# EAGLE design raspihat-1 (EAGLE 9.2.0)

## Sheet 1 of 2
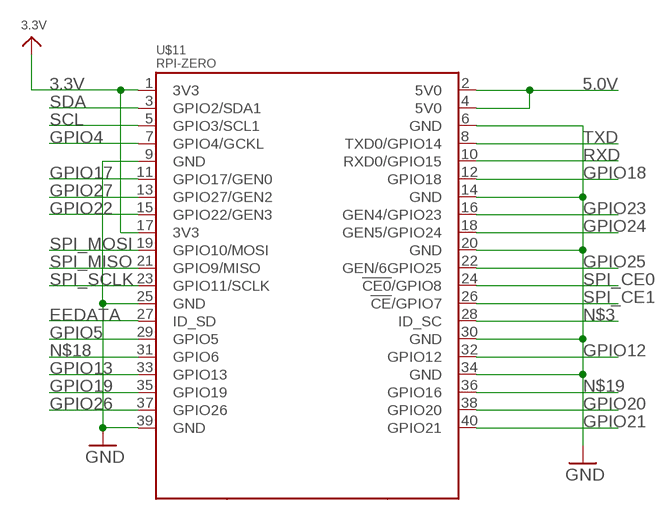
[diagram p0: schematic, sheet 1]

### Parts
U$11  RPI-ZERO  [RASPBERRYPI_BASTELSTUBE_V13_RASPI_BOARD_B+_FULL]

### Nets
3.3V: U$11.1(3V3) U$11.17(3V3) ; also sheet 2
5.0V: U$11.2(5V0) U$11.4(5V0) ; also sheet 2
EEDATA: U$11.27(ID_SD)
GND: U$11.6(GND) U$11.9(GND) U$11.14(GND) U$11.20(GND) U$11.25(GND) U$11.30(GND) U$11.34(GND) U$11.39(GND) ; also sheet 2
GPIO4: U$11.7(GPIO4/GCKL) ; also sheet 2
GPIO5: U$11.29(GPIO5)
GPIO12: U$11.32(GPIO12)
GPIO13: U$11.33(GPIO13)
GPIO17: U$11.11(GPIO17/GEN0) ; also sheet 2
GPIO18: U$11.12(GPIO18) ; also sheet 2
GPIO19: U$11.35(GPIO19)
GPIO20: U$11.38(GPIO20)
GPIO21: U$11.40(GPIO21) ; also sheet 2
GPIO22: U$11.15(GPIO22/GEN3)
GPIO23: U$11.16(GEN4/GPIO23)
GPIO24: U$11.18(GEN5/GPIO24)
GPIO25: U$11.22(GEN/6GPIO25) ; also sheet 2
GPIO26: U$11.37(GPIO26) ; also sheet 2
GPIO27: U$11.13(GPIO27/GEN2)
N$3: U$11.28(ID_SC)
N$18: U$11.31(GPIO6)
N$19: U$11.36(GPIO16)
RXD: U$11.10(RXD0/GPIO15)
SCL: U$11.5(GPIO3/SCL1) ; also sheet 2
SDA: U$11.3(GPIO2/SDA1) ; also sheet 2
SPI_CE0: U$11.24(!CE0!/GPIO8)
SPI_CE1: U$11.26(!CE!/GPIO7)
SPI_MISO: U$11.21(GPIO9/MISO)
SPI_MOSI: U$11.19(GPIO10/MOSI)
SPI_SCLK: U$11.23(GPIO11/SCLK)
TXD: U$11.8(TXD0/GPIO14)

## Sheet 2 of 2: Systems
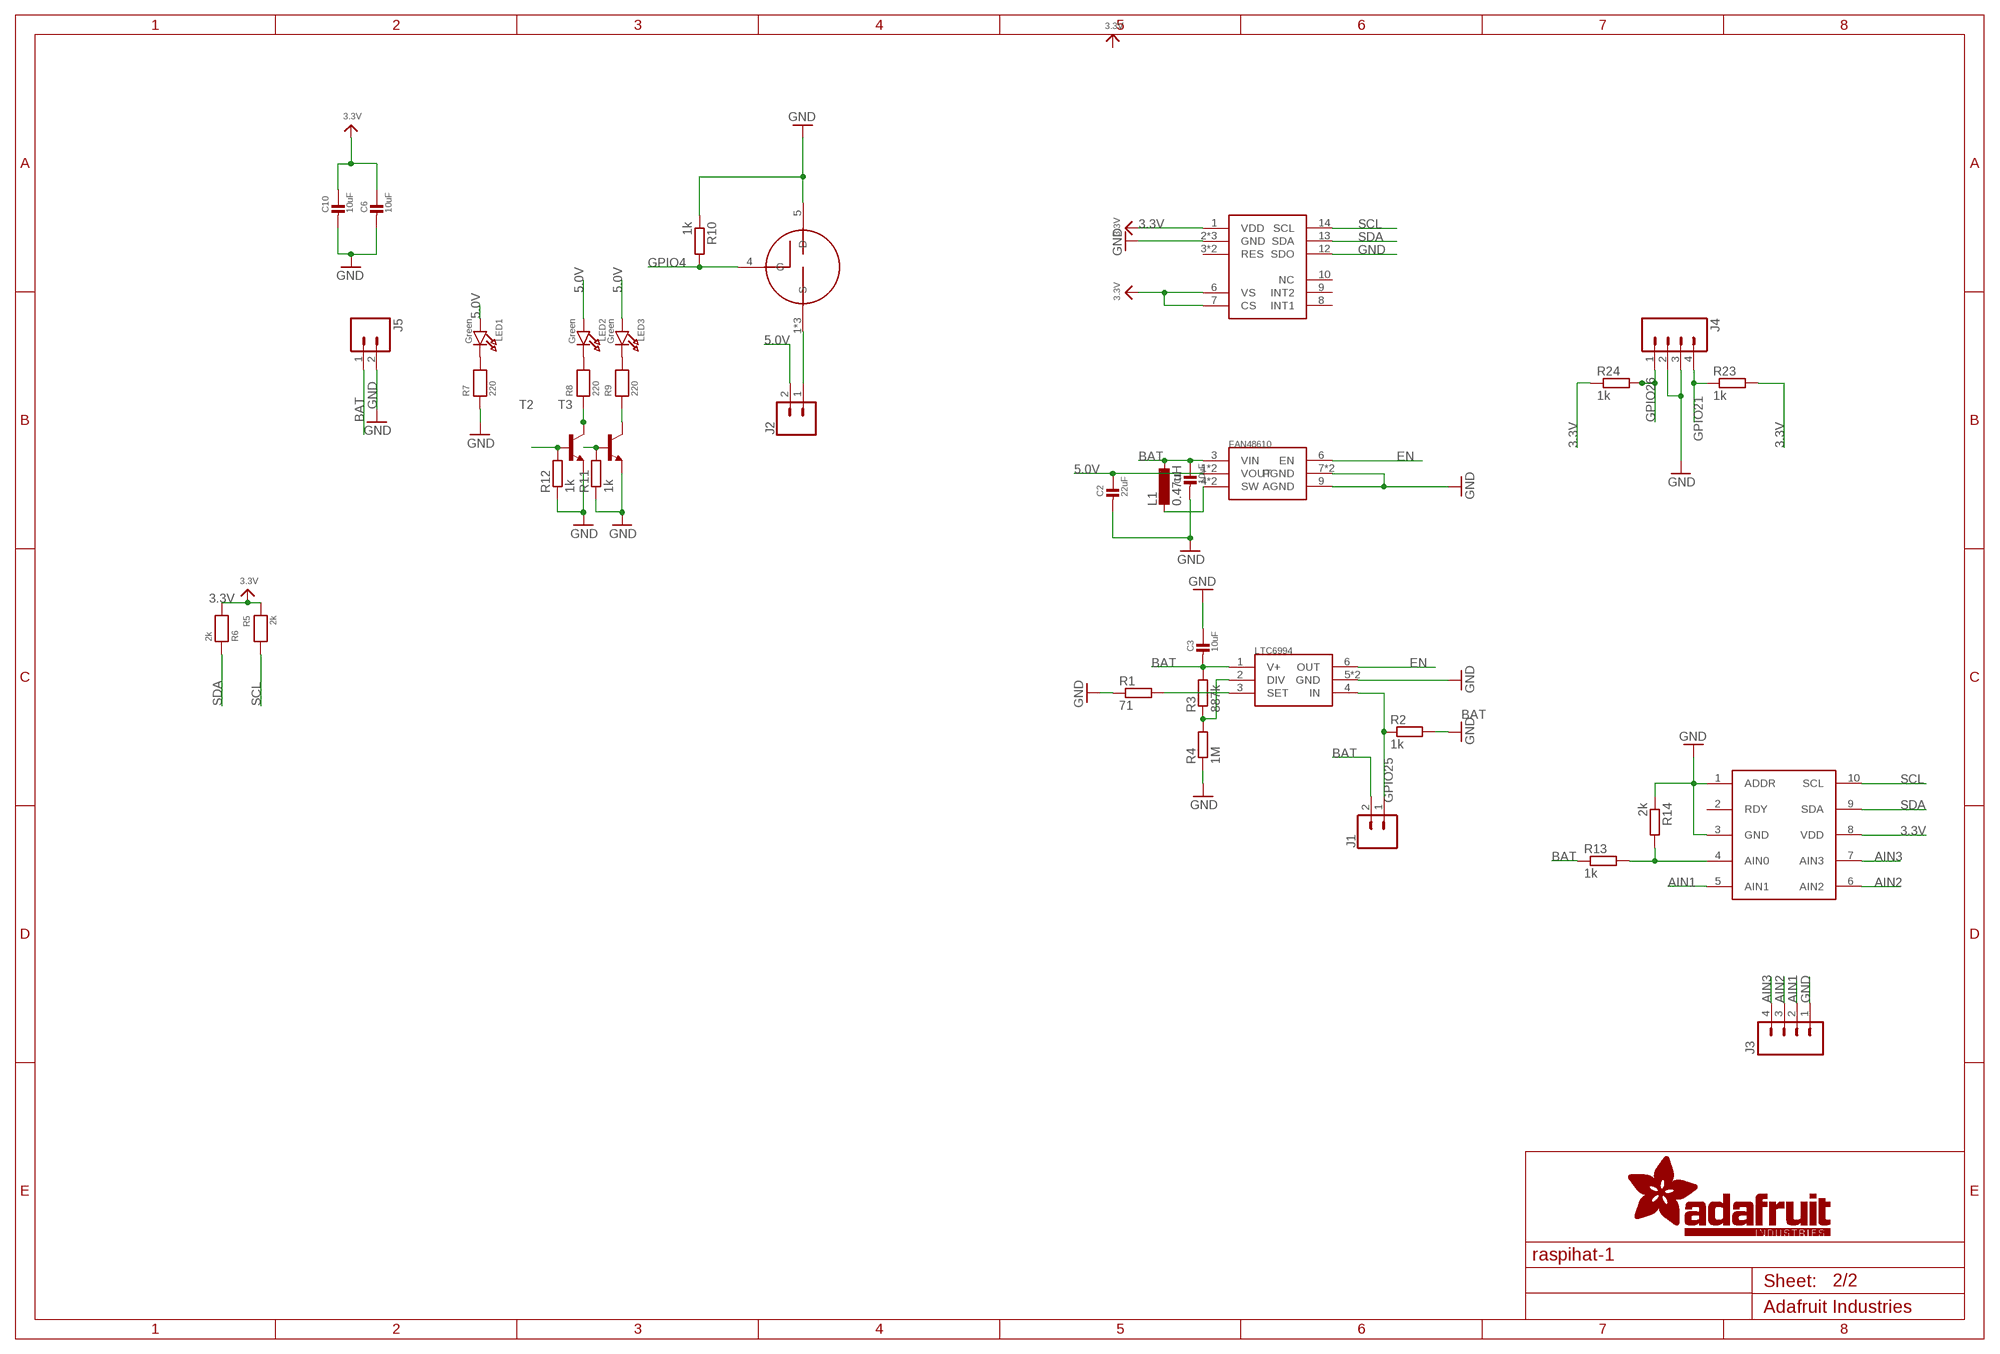
[diagram p1: schematic, sheet 2]

### Parts
C1  10uF  CAP_CERAMIC0805-NOOUTLINE  [0805-NO]
C2  22uF  CAP_CERAMIC0805-NOOUTLINE  [0805-NO]
C3  10uF  CAP_CERAMIC0805-NOOUTLINE  [0805-NO]
C6  10uF  CAP_CERAMIC0805-NOOUTLINE  [0805-NO]
C10  10uF  CAP_CERAMIC0805-NOOUTLINE  [0805-NO]
J1  CONN_02  [1X02]
J2  CONN_02  [1X02]
J3  M04JST  [1X04-1.5MM_JST]
J4  M04JST  [1X04-1.5MM_JST]
J5  M02PTH  [1X02]
L1  0.47uH  L-EUL2012C  [L2012C]
LED1  Green  LED0805_NOOUTLINE  [CHIPLED_0805_NOOUTLINE]
LED2  Green  LED0805_NOOUTLINE  [CHIPLED_0805_NOOUTLINE]
LED3  Green  LED0805_NOOUTLINE  [CHIPLED_0805_NOOUTLINE]
R1  71  R-EU_R0603  [R0603]
R2  1k  R-EU_R0805  [R0805]
R3  887k  R-EU_R0603  [R0603]
R4  1M  R-EU_R0805  [R0805]
R5  2k  RESISTOR0805_NOOUTLINE  [0805-NO]
R6  2k  RESISTOR0805_NOOUTLINE  [0805-NO]
R7  220  RESISTOR0805_NOOUTLINE  [0805-NO]
R8  220  RESISTOR0805_NOOUTLINE  [0805-NO]
R9  220  RESISTOR0805_NOOUTLINE  [0805-NO]
R10  1k  R-EU_R0805  [R0805]
R11  1k  R-EU_R0805  [R0805]
R12  1k  R-EU_R0805  [R0805]
R13  1k  R-EU_R0805  [R0805]
R14  2k  R-EU_R0805  [R0805]
R23  1k  R-EU_R0805  [R0805]
R24  1k  R-EU_R0805  [R0805]
T2  MMBT6517LT1-NPN-SOT23-BEC  [SOT23-BEC]
T3  MMBT6517LT1-NPN-SOT23-BEC  [SOT23-BEC]
U$3  ADXL345  [LGA14]
U$5  FAN48610  [WLCSP-9]
U$6  LTC6994  [DFN-6]
U$8  BUK9M  [LFPAK33]
U$15  ADS1015  [VSSOP10]

### Nets
3.3V: C6.1 C10.1 R5.1 R6.2 R23.2 R24.1 U$3.1(VDD) U$3.6(VS) U$3.7(CS) U$15.8(VDD) ; also sheet 1
5.0V: C2.1 J2.2 LED1.A LED2.A LED3.A U$5.1(VOUT) U$5.2(VOUT) ; also sheet 1
AIN1: J3.2 U$15.5(AIN1)
AIN2: J3.3 U$15.6(AIN2)
AIN3: J3.4 U$15.7(AIN3)
BAT: C1.1 C3.2 J1.2 J5.1 L1.1 R3.2 R13.1 U$5.3(VIN) U$6.1(V+)
EN: U$5.6(EN) U$6.6(OUT)
GND: C1.2 C2.2 C3.1 C6.2 C10.2 J3.1 J4.2 J4.3 J5.2 R1.1 R2.2 R4.1 R7.1 R10.1 R11.1 R12.1 R14.1 T2.E T3.E U$3.2(GND) U$3.4(GND) U$3.5(GND) U$3.12(SDO) U$5.7(PGND) U$5.8(PGND) U$5.9(AGND) U$6.5(GND) U$6.P$1(GND) U$8.5(D) U$15.1(ADDR) U$15.3(GND) ; also sheet 1
GPIO4: R10.2 U$8.4(G) ; also sheet 1
GPIO17: R12.2 T2.B ; also sheet 1
GPIO18: R11.2 T3.B ; also sheet 1
GPIO21: J4.4 R23.1 ; also sheet 1
GPIO25: J1.1 R2.1 U$6.4(IN) ; also sheet 1
GPIO26: J4.1 R24.2 ; also sheet 1
N$1: R1.2 U$6.3(SET)
N$2: R3.1 R4.2 U$6.2(DIV)
N$4: R13.2 R14.2 U$15.4(AIN0)
N$5: L1.2 U$5.4(SW) U$5.5(SW)
N$6: LED2.C R8.2
N$7: LED3.C R9.2
N$8: R8.1 T2.C
N$11: R9.1 T3.C
N$12: J2.1 U$8.1(S) U$8.2(S) U$8.3(S)
N$133: LED1.C R7.2
SCL: R5.2 U$3.14(SCL) U$15.10(SCL) ; also sheet 1
SDA: R6.1 U$3.13(SDA) U$15.9(SDA) ; also sheet 1
Unconnected: U$3.3(RES) U$3.8(INT1) U$3.9(INT2) U$3.10(NC) U$3.11(RES) U$15.2(RDY)

## Library data of the parts
C1-C3 C6 C10 = microbuilder:CAP_CERAMIC: Ceramic Capacitors For new designs, use the packages preceded by an '_' character since they are more reliable: The following footprints should be used on most boards: _0402 - Standard footprint for regular board layouts _0603 - Standard footprint for regular board layouts _0805 - Standard footprint for regular board layouts For extremely tight-pitch boards where space is at a premium, the following 'micro-pitch' footprints can be used (smaller pads, no silkscreen outline, etc.): _0402MP - Micro-pitch footprint for very dense/compact boards _0603MP - Micro-pitch footprint for very dense/compact boards _0805MP - Micro-pitch footprint for very dense/compact boards Commonly Stocked Parts 0402 - 0402 Surface Mount Capacitors 16pF 50V 5% [Digikey: 445-4899-2-ND] 18pF 50V 5% [Digikey: 490-1281-2-ND] 22pF 50V 5% [Digikey: 490-1283-2-ND] 68pF 50V 5% [Digikey: 490-1289-2-ND] 0.1uF 10V 10% [Digikey: 490-1318-2-ND] 1.0uF 6.3V 10% [Digikey: 490-1320-2-ND] 0603 - 0603 Surface Mount Capacitors 16 pF 50V 5% [Digikey: 445-5051-2-ND] 22 pF 50V [Digikey: PCC220ACVTR-ND] 33 pF 50V 5% [Digikey: 490-1415-1-ND] 56pF 50V 5% [Digikey: 490-1421-1-ND] 220pF 50V 5% [Digikey: 445-1285-1-ND] 680 pF 50V 2200 pF 50V 5% C0G [Digikey: 445-1297-1-ND] 5600 pF 100V 5% X7R [Digikey: 478-3711-1-ND] 0.1 µF 25V 10% [Digikey: PCC2277TR-ND] 0.22 µF 16V 10% X7R [Digikey: 445-1318-1-ND] 1.0 µF 25V 10% [Digikey: 445-5146-2-ND] 0603 - RF Specific 3pF 250V +/-0.1pF RF [Digikey: 712-1347-1-ND] 18 pF 250V 5% [Digikey: 478-3505-1-ND or 712-1322-1-ND] 56 pF 250V 5% C0G RF [Digikey: 490-4867-1-ND] 68 pF 250V RF [Digikey: 490-4868-1-ND] 0805 - 0805 Surface Mount Capacitors 220 pF 250V 2% RF Ceramic Capacitor [Digikey: 712-1398-1-ND] 1000 pF 50V 2% NP0 Ceramic Capacitor [Digikey: 478-3760-1-ND] 0.1 µF 25V 10% Ceramic Capacitor [Digikey: PCC1828TR-ND] 1.0 µF 16V 10% Ceramic Capacitor[Digikey: 490-1691-2-ND] 10.0 µF 10V 10% Ceramic Capacitor[Digikey: 709-1228-1-ND] 10.0 uF 16V 10% Ceramic Capacitor [Digikey: 478-5165-2-ND] 47 uF 6.3V 20% Ceramic Capacitor [Digikey: 587-1779-1-ND or 399-5506-1-ND] 1206 - 1206 Surface Mount Capacitors 47uF 10V 20% Ceramic Capacitor [Digikey: 490-5528-1-ND or 399-5508-1-ND or 445-6010-1-ND] 100uF 6.3V -20%, +80% Y5V Ceramic Capacitor (Digikey: 490-4512-1-ND, Mouser: 81-GRM31CF50J107ZE1L)
J1 J2 = SparkFun-Connectors:CONN_02: Multi connection point. Often used as Generic Header-pin footprint for 0.1 inch spaced/style header connections On any of the 0.1 inch spaced packages, you can populate with these: Break Away Headers - Straight <https://www.sparkfun.com/products/116> (PRT-00116) Break Away Male Headers - Right Angle <https://www.sparkfun.com/products/553> (PRT-00553) Female Headers <https://www.sparkfun.com/products/115> (PRT-00115) Break Away Headers - Machine Pin <https://www.sparkfun.com/products/117> (PRT-00117) Break Away Female Headers - Swiss Machine Pin <https://www.sparkfun.com/products/743> (PRT-00743) For SCREWTERMINALS and SPRING TERMINALS visit here: Screw Terimnals on SparkFun.com <https://www.sparkfun.com/search/results?term=Screw+Terminals> (5mm/3.5mm/2.54mm spacing) This device is also useful as a general connection point to wire up your design to another part of your project. Our various solder wires solder well into these plated through hole pads. Hook-Up Wire - Assortment (Stranded, 22 AWG) <https://www.sparkfun.com/products/11375> (PRT-11375) Hook-Up Wire - Assortment (Solid Core, 22 AWG) <https://www.sparkfun.com/products/11367> (PRT-11367) View the entire wire category on our website here <https://www.sparkfun.com/categories/141> Special notes: Molex polarized connector foot print use with: PRT-08233 with associated crimp pins and housings. 2.54_SCREWTERM for use with PRT-10571. 3.5mm Screw Terminal footprints for PRT-08084 5mm Screw Terminal footprints for use with PRT-08432
J3 J4 = SparkFun-Connectors:M04: Header 4 Standard 4-pin 0.1" header. Use with straight break away headers (SKU : PRT-00116), right angle break away headers (PRT-00553), swiss pins (PRT-00743), machine pins (PRT-00117), and female headers (PRT-00115). Molex polarized connector foot print use with SKU : PRT-08231 with associated crimp pins and housings. 1MM SMD Version SKU: PRT-10208; PROD_ID: CONN-12477
J5 = SparkFun-Connectors:M02: Standard 2-pin 0.1" header. Use with - straight break away headers ( PRT-00116) - right angle break away headers (PRT-00553) - swiss pins (PRT-00743) - machine pins (PRT-00117) - female headers (PRT-00115) Molex polarized connector foot print use with: PRT-08233 with associated crimp pins and housings. 2.54_SCREWTERM for use with PRT-10571. 3.5mm Screw Terminal footprints for PRT-08084 5mm Screw Terminal footprints for use with PRT-08432
L1 = rcl:L-EU: INDUCTOR, European symbol; SPICEPREFIX: L
LED1-LED3 = microbuilder:LED: LED 0603 - 0603 Surface Mount Package 2mA: Green LED - Low Power (3.9mcd, 2ma, 1.7Vf) - Digikey: 475-2709-2-ND Orange LED - Low Power (9.8mcd, 2ma, 1.8Vf) - Digikey: 475-1194-2-ND Red LED - Low Power (5mcd, 2ma, 1.8Vf) - Digikey: 475-1195-2-ND Yellow LED - Low Power (7mcd, 2ma, 1.8Vf) - Digikey: 475-1196-2-ND 5mA: Blue LED - Low Power (17mcd, 5ma, 2.9Vf) - Digikey: LNJ937W8CRACT-ND 0805 - 0805 Surface Mount Package 2mA: Red LED (8.8mcd, 2mA, 1.8Vf, Clear) - Low Power [Digikey: 475-2510-1-ND] Green LED (5mcd, 2mA, 1.8Vf, Clear) - Low Power [Digikey: 475-2730-1-ND] Yellow LED (11.3mcd, 2mA, 1.8Vf, Clear) - Low Power [Digikey: 475-2555-1-ND] 20mA: Red LED (104mcd, 20mA, Diffused) - LS R976 [Digikey: 475-1278-6-ND] Red LED (12mcd, 20mA, 2.0Vf, Clear) - APT2012EC [Digikey: 754-1128-1-ND] Green LED (15mcd, 20mA, 2.2Vf, Clear) - APT2012GC [Digikey: 754-1131-1-ND] Orange LED (160mcd, 20mA, 2.1Vf, Clear) - APT2012SECK [Digikey: 754-1130-1-ND] 1206 - 1206 Surface Mount Package Green LED (26mcd, 20mA, Diffused) - LG N971 [Digikey: 475-1407-6-ND] Red LED (15mcd, 20mA, Diffused) - LH N974 [Digikey: 475-1416-6-ND] Cree - Cree High-Power Surface Mount LEDs XPEBWT-L1-0000-00D50 - White 111lm 350mA 2.9Vf 6200K 110° XTEAWT-00-0000-00000LEE3 - White 114lm 350mA 2.85Vf 5000K 115° Everlight - Everlight 45-21 Series Surface Mount LEDs 45-21/QK2C-B2832AC2CB2/2T - Warm White 2000mcd 20mA 3.25Vf 3050K 120° 45-21/LK2C-B38452C4CB2/2T - Nuetral White 2000mcd 20mA 3.25Vf 4150K 120° 45-21/LK2C-B50634C6CB2/2T - Cold White 2200mcd 20mA 3.25Vf 5650K 120° PLCC2 Reverse Mount LS T77K-J1L2-1-0-2-R18-Z - Red 11.25mcd 2mA 1.8Vf 630nm 120° LO T77K-L1M2-24-Z - Orange 19.6mcd 2mA 1.8Vf 606nm 120° LY T77K-K2M1-26-Z - Yellow 15.7mcd 2mA 1.8Vf 587nm 120°
R1-R4 R10-R14 R23 R24 = rcl:R-EU_: RESISTOR, European symbol; SPICEPREFIX: R
R5-R9 = microbuilder:RESISTOR: Resistors For new designs, use the packages preceded by an '_' character since they are more reliable: The following footprints should be used on most boards: _0402 - Standard footprint for regular board layouts _0603 - Standard footprint for regular board layouts _0805 - Standard footprint for regular board layouts For extremely tight-pitch boards where space is at a premium, the following 'micro-pitch' footprints can be used (smaller pads, no silkscreen outline, etc.): _0402MP - Micro-pitch footprint for very dense/compact boards _0603MP - Micro-pitch footprint for very dense/compact boards _0805MP - Micro-pitch footprint for very dense/compact boards
T2 T3 = transistor:*-NPN-: NPN Transistror BF959 corrected 2008.03.06
U$3 = abysscore:ADXL345
U$5 = abysscore:FAN48610
U$6 = abysscore:LTC6994
U$8 = abysscore:BUK9M
U$11 = RPI-Zero:RPI-ZERO
U$15 = abysscore:ADS1015

## Board
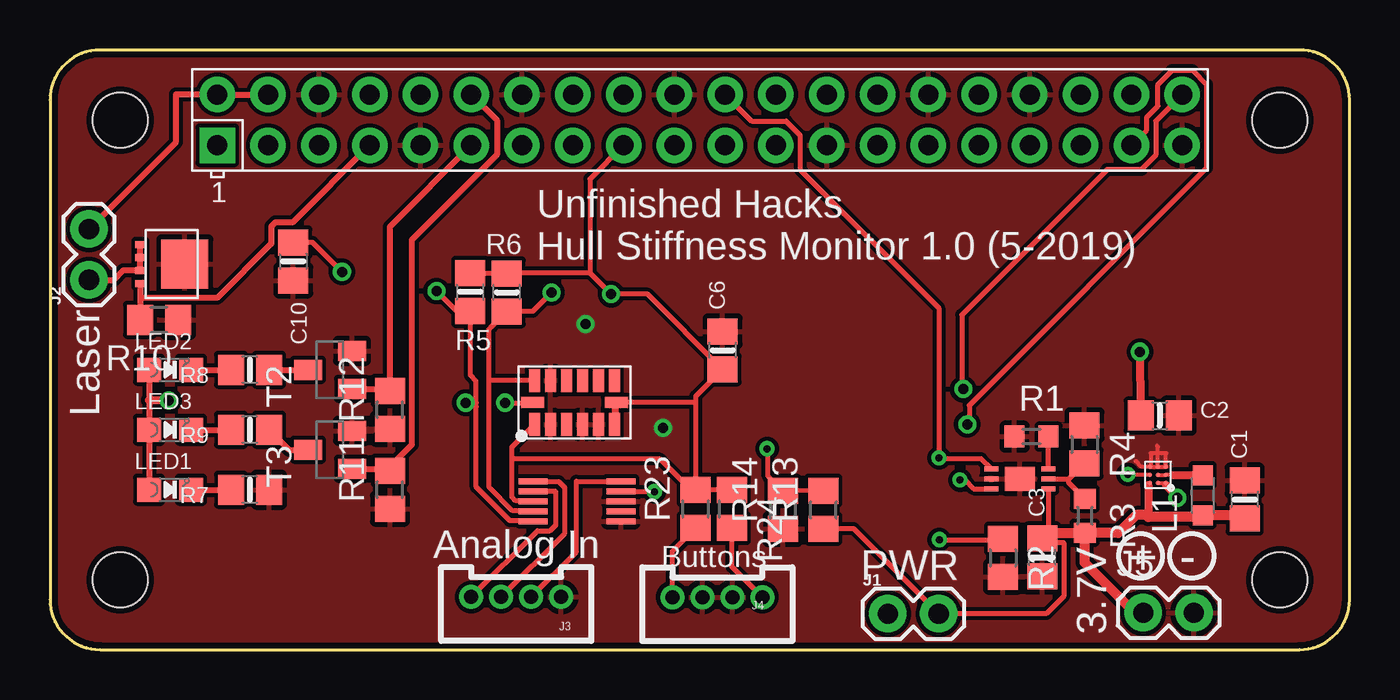
[diagram p2: board, top side]
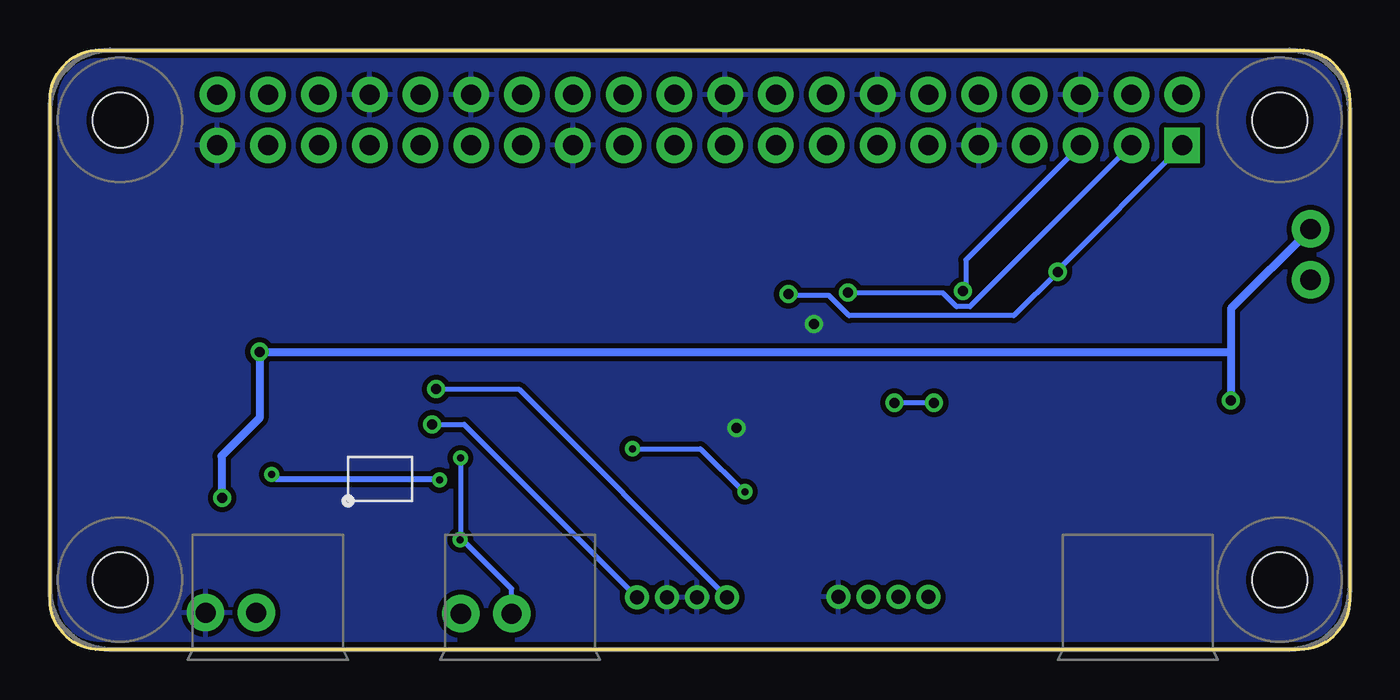
[diagram p3: board, bottom side, seen from below]

Size 65 x 30 mm. Coordinates in mm from the lower left corner, seen from the top.
Outline: 0,2.5 arc90 2.5,0 62.5,0 arc90 65,2.5 65,27.5 arc90 62.5,30 2.5,30 arc90 0,27.5 0,2.5
Copper layers (1*16): Top 0.035mm / dielectric 1.5mm / Bottom 0.035mm
Design rules "adafruit *": minimum track width 0.2mm, minimum drill 0.3mm, track to track 8mil, track to pad 0.2mm, pad to pad 0.2mm, via to via 8mil, smd to smd 0.2mm, copper to edge 0.3mm, drill to drill 0.3mm, minimum pad ring 10mil, minimum via ring 8mil, stop-mask expansion 2mil, vias tented up to drill 20mil, thermal gap 10mil

### Footprints (pad centres in the part's own frame; a part is rotated, then mirrored left to right if it is on the bottom)
0805-NO = smd 1.3 x 1.5: 1 -0.95,0; 2 0.95,0
1X02 = drill 1.016 pad 1.88: 1 0,0; 2 2.54,0
1X04-1.5MM_JST = drill 0.7: 1 0,0; 2 1.5,0; 3 3,0; 4 4.5,0
1X02' = drill 1 pad 1.88: 1 0,0; 2 2.54,0
L2012C = smd 1 x 1: 1 -1,0; 2 1,0
CHIPLED_0805_NOOUTLINE = smd 1.2 x 1.2: A 0,-1.05; C 0,1.05
R0603 = smd 1 x 1.1: 1 -0.85,0; 2 0.85,0
R0805 = smd 1.3 x 1.5: 1 -0.95,0; 2 0.95,0
SOT23-BEC = smd 1 x 1.4: B -0.95,-1.1; C 0,1.1; E 0.95,-1.1
LGA14 = smd 1.145 x 0.55: 1 -1.097,2; 2 -1.097,1.2; 3 -1.097,0.4; 4 -1.097,-0.4; 5 -1.097,-1.2; 6 -1.097,-2; 8 1.097,-2; 9 1.097,-1.2; 10 1.097,-0.4; 11 1.097,0.4; 12 1.097,1.2; 13 1.097,2 | smd 0.55 x 1.145: 7 0,-2.098; 14 0,2.098
WLCSP-9 = smd 0.215 x 0.215: 1 -0.4,0.4; 2 0,0.4; 3 0.4,0.4; 4 -0.4,0; 5 0,0; 6 0.4,0; 7 -0.4,-0.4; 8 0,-0.4; 9 0.4,-0.4
DFN-6 = smd 0.25 x 0.7: 1 -0.5,-1.425; 2 0,-1.425; 3 0.5,-1.425; 4 0.5,1.425; 5 0,1.425; 6 -0.5,1.425 | smd 1.2 x 1.5: P$1 0,0
LFPAK33 = smd 0.35 x 0.5: 1 -0.975,-0.775; 2 -0.325,-0.775; 3 0.325,-0.775; 4 0.975,-0.775 | smd 2.45 x 2.35: 5 0,1.45
RASPBERRYPI_BASTELSTUBE_V13_RASPI_BOARD_B+_FULL = drill 1 pad 1.778 square: 1 8.37,25.23 | drill 1 pad 1.778: 2 8.37,27.77; 3 10.91,25.23; 4 10.91,27.77; 5 13.45,25.23; 6 13.45,27.77; 7 15.99,25.23; 8 15.99,27.77; 9 18.53,25.23; 10 18.53,27.77; 11 21.07,25.23; 12 21.07,27.77; 13 23.61,25.23; 14 23.61,27.77; 15 26.15,25.23; 16 26.15,27.77; 17 28.69,25.23; 18 28.69,27.77; 19 31.23,25.23; 20 31.23,27.77; 21 33.77,25.23; 22 33.77,27.77; 23 36.31,25.23; 24 36.31,27.77; 25 38.85,25.23; 26 38.85,27.77; 27 41.39,25.23; 28 41.39,27.77; 29 43.93,25.23; 30 43.93,27.77; 31 46.47,25.23; 32 46.47,27.77; 33 49.01,25.23; 34 49.01,27.77; 35 51.55,25.23; 36 51.55,27.77; 37 54.09,25.23; 38 54.09,27.77; 39 56.63,25.23; 40 56.63,27.77 | hole 2.75: 3.5,3.5; 3.5,26.5; 61.5,3.5; 61.5,26.5
VSSOP10 = smd 1.45 x 0.3: 1 -2.2,1; 2 -2.2,0.5; 3 -2.2,0; 4 -2.2,-0.5; 5 -2.2,-1; 6 2.2,-1; 7 2.2,-0.5; 8 2.2,0; 9 2.2,0.5; 10 2.2,1

### Placement (x,y rotation side)
C1  59.76,7.51 90 top
C2  55.5,11.71 0 top
C3  49.63,4.61 90 top
C6  33.65,14.97 90 top
C10  12.17,19.42 270 top
J1  41.91,1.79 0 top
J2  1.95,18.5 90 top
J3  25.57,2.63 180 top
J4  35.63,2.62 180 top
J5  [1X02']  54.68,1.84 0 top
L1  57.66,7.72 90 top
LED1  6,8 270 top
LED2  6,14 270 top
LED3  6,11 270 top
R1  49.09,10.66 0 top
R2  47.67,4.59 270 top
R3  51.76,6.7 270 top
R4  51.74,10.27 270 top
R5  21.01,17.89 270 top
R6  22.85,17.87 90 top
R7  10,8 180 top
R8  10,14 180 top
R9  10,11 180 top
R10  5.45,16.49 180 top
R11  17,8 90 top
R12  17,12 90 top
R13  38.68,6.99 90 top
R14  36.66,6.98 90 top
R23  32.29,7.03 90 top
R24  34.1,7.03 270 top
T2  14,14 90 top
T3  14,10 90 top
U$3  26.23,12.36 90 top
U$5  55.42,8.74 180 top
U$6  48.5,8.54 90 top
U$8  5.29,19.29 270 top
U$11  0,0 0 top
U$15  26.35,7.42 180 top

### Tracks (layer width: path | path; a pad name or v marks a point on that pad's centre or on a via)
3.3V  (via drill 0.5)
  Top 0.25: 12.24,20.45 C10.1 13.13,20.37 v14.6,18.9 | 22.45,18.43 R6.2 22.83,18.84 | U$15.8 24.12,7.45 23.29,7.45 23.1,7.63 23.1,9.51 | 23.1,9.51 23.1,10.13 U$3.1 | R5.1 22.83,18.84 | R24.1 R23.2 | R23.2 32.06,7.98 30.51,9.53 23.12,9.53 23.1,9.51 | 27.01,18.84 v28.07,17.78 29.89,17.78 C6.1 32.29,12.66 32.29,12.36 | 27.01,18.84 22.83,18.84 | U$11.17 27.01,23.55 27.01,18.84 | 32.29,12.36 R23.2 | U$3.7 28.33,11.36 U$3.6 28.23,12.26 U$3.7 32.29,12.36
  Top 0.3: 33.7,13.97 C6.1 | C10.1 11.89,20.1
  Top 0.305: 33.7,13.97 C6.1
  Bottom 0.25: U$11.1 14.6,19 v14.6,18.9 16.8,16.7 25.03,16.7 26.05,17.72 28.13,17.72 v28.07,17.78
5.0V  (via drill 0.5)
  Top 0.2: U$5.2 U$5.1 55.82,8.23
  Top 0.3: LED2.A 4.95,12.47 LED3.A LED1.A | J2.2 6.3,25.39 6.3,27.78 U$11.2 U$11.4
  Top 0.4: v56.39,7.59 56.39,7.66 55.82,8.23 | C2.1 54.55,13.4 54.54,13.41 54.54,14.88 v54.52,14.9 | v5.93,12.47 4.95,12.47
  Bottom 0.4: v56.39,7.59 56.42,7.62 56.42,9.68 54.52,11.58 v54.52,14.9 6.05,14.9 5.93,14.78 | J2.2 5.93,17.06 5.93,14.78 | 5.93,14.78 v5.93,12.47 5.93,12.43
AIN1
  Top 0.25: J3.2 26.33,4.89 26.33,8.42 U$15.5
AIN2
  Top 0.25: U$15.6 24.18,8.39 25.46,8.39 25.75,8.1 25.75,5.81 J3.3
AIN3
  Top 0.25: J3.4 24.39,5.95 25.01,5.95 25.3,6.24 25.3,7.91 U$15.7
BAT
  Top 0.2: U$5.3 55.02,8.14 54.93,8.23
  Top 0.25: U$6.1 49.92,5.86 C3.2 49.63,5.34 50.7,5.34 50.7,2.67 49.83,1.79 J1.2 40.2,6.04 R13.1
  Top 0.4: 54.93,8.23 54.93,6.73 54.93,6.63
  Top 0.5: J5.1 54.26,1.84 51.76,4.34 R3.2 | C3.2 49.92,5.85 R3.2 | 54.93,6.63 57.57,6.63 L1.1 59.6,6.72 C1.1 | 54.93,6.73 54.33,6.73 53.43,5.83 51.78,5.83 R3.2
EN  (via drill 0.35)
  Top 0.2: U$5.6 54.13,8.74 54.11,8.76
  Top 0.25: v45.52,8.48 45.75,8.48 46.19,8.04 U$6.6
  Top 0.3: 54.11,8.76 v53.91,8.76
  Bottom 0.3: v53.91,8.76 53.68,8.53 45.57,8.53 v45.52,8.48
GND  (via drill 0.5)
  Top 0.2: U$5.9 55.06,9.18 55.06,9.82 55.85,9.82 55.82,9.79 U$5.7 U$5.8 U$5.9 54.59,9.14 54.3,9.43 | U$5.9 | U$5.9 U$5.8 55.42,10.16 55.38,10.2
  other vias: 26.78,16.28 30.67,11.08
  pour Bottom (isolate 0.254): -1,-1 -1,31 66,31 66,-1
  pour Top: -2,32 67,32 67,-2 62.85,-2.35 2.2,-2.35 -2,-2
GPIO4
  Top 0.3: U$8.4 4.51,17.6 | 4.51,17.6 4.51,16.5 R10.2 | 4.51,17.6 8.36,17.6 11.07,20.31 11.07,21.17 11.27,21.37 12.13,21.37 U$11.7
GPIO17
  Top 0.3: T2.B 16.9,13.05 R12.2 17,21.16 U$11.11
GPIO18
  Top 0.3: T3.B 16.9,9.05 R11.2 17,9.15 18.1,10.26 18.1,20.51 22.35,24.76 22.35,26.49 U$11.12
GPIO21  (via drill 0.5)
  Top 0.25: J4.4 31.13,4.92 R23.1 | U$11.40 55.3,26.44 55.3,24.73 54.59,24.02 52.88,24.02 45.61,16.75 45.61,13 45.65,13 v45.68,13.03
  Bottom 0.25: v45.68,13.03 41.54,13.03 J4.4
GPIO25  (via drill 0.35)
  Top 0.25: v44.48,5.5 47.63,5.5 R2.1 | U$6.4 46.56,9.55 44.45,9.55 44.45,9.57 | 44.45,9.57 v44.47,9.59 | 44.45,9.57 44.45,17.09 37.52,24.02 37.52,25.73 36.81,26.44 35.1,26.44 U$11.22
  Bottom 0.25: J1.1 41.91,3.04 44.41,5.54 44.56,5.54 | 44.56,5.54 44.52,5.5 v44.48,5.5 | v44.47,9.59 44.47,5.63 44.56,5.54
GPIO26  (via drill 0.5)
  Top 0.25: J4.1 34.1,4.15 R24.2 | U$11.37 54.85,25.99 54.85,26.63 55.42,27.2 55.42,28.27 56.13,28.98 57.13,28.98 57.84,28.27 57.84,24.09 45.98,12.22 45.98,11.04 45.88,11.14 v45.88,11.27
  Bottom 0.25: v45.88,11.27 44.28,11.27 J4.1
N$1
  Top 0.25: U$6.3 49.92,10.64 R1.2
N$2
  Top 0.25: U$6.2 50.96,8.54 | 50.96,8.54 R4.2 | R3.1 50.96,8.35 50.96,8.54
N$4  (via drill 0.35)
  Top 0.25: R13.2 36.69,7.96 R14.2 35.92,8.67 35.92,9.97 35.87,10.02 v35.87,10.05 | v30.24,7.9 28.57,7.9 U$15.4
  Bottom 0.25: v35.87,10.05 32.47,10.05 30.3,7.88 30.26,7.88 v30.24,7.9
N$5
  Top 0.2: U$5.5 U$5.4 56.15,8.74 56.17,8.72
  Top 0.4: L1.2 56.17,8.72
N$6
  Top 0.3: LED2.C R8.2
N$7
  Top 0.3: LED3.C R9.2
N$8
  Top 0.3: R8.1 T2.C
N$11
  Top 0.3: R9.1 11.95,10 T3.C
N$12
  Top 0.3: J2.1 3.19,18.5 3.67,18.98 4.5,18.98 U$8.3 U$8.2 U$8.1
N$133
  Top 0.3: LED1.C R7.2
SCL  (via drill 0.5)
  Top 0.25: U$15.10 24.12,6.45 23.01,6.45 21.32,8.13 21.32,12.15 | 21.32,12.15 21.32,12.35 v20.78,12.35 | v22.76,12.35 U$3.14 | 21.32,12.15 21.29,12.18 21.29,13.45 21.01,13.73 R5.2 20.33,16.94 v19.33,17.94
  Bottom 0.25: v20.78,12.35 v22.76,12.35 | U$11.5 19.19,19.49 19.19,18.08 v19.33,17.94
SDA  (via drill 0.5)
  Top 0.25: U$15.9 24.12,6.95 23.15,6.95 21.95,8.14 21.95,13.48 | 21.95,13.48 24.21,13.48 U$3.13 | 21.95,13.48 21.95,16.02 22.09,16.16 R6.1 24.14,16.92 v25.08,17.86
  Bottom 0.25: U$11.3 18.98,17.16 19.65,17.16 20.34,17.85 v25.07,17.85 v25.08,17.86

### Text on the board
tPlace: + | -
tNames: Unfinished Hacks / Hull Stiffness Monitor 1.0 (5-2019) | Laser | Analog In | Buttons | PWR | 3.7V